# EAGLE design quad-ultimax-cartridge (EAGLE 9.4.0)
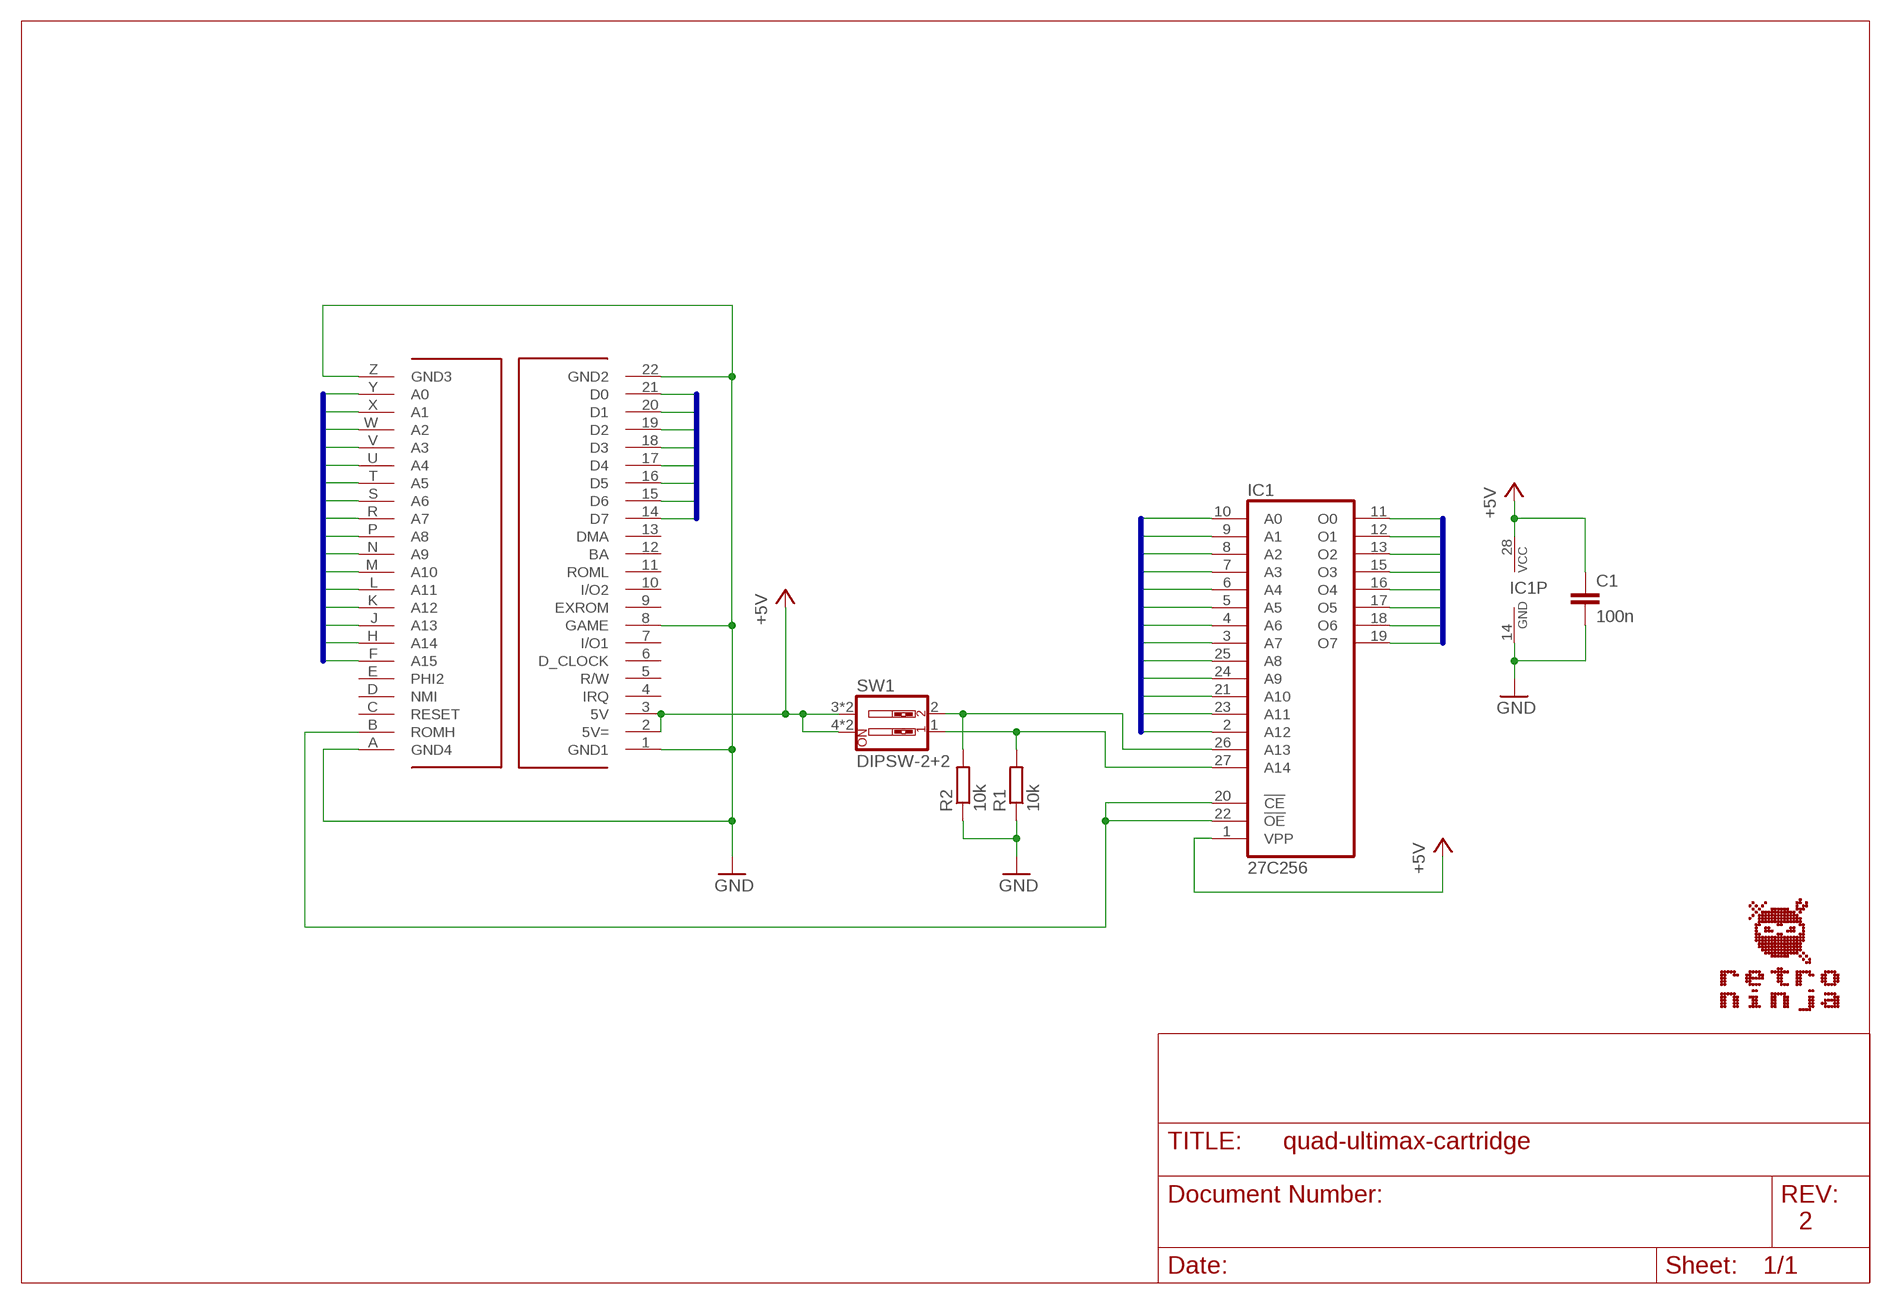
[diagram p0: schematic, sheet 1]

## Parts
C1  100n  CAPACITOR  [CAP_5MM_2.5X5.0_ROUND]
IC1  27C256  27256  [DIL28]
R1  10k  RESISTOR10MM  [0207/10]
R2  10k  RESISTOR10MM  [0207/10]
SW1  DIPSW-2+2  [DIPSW2+2]
U$1  C64CARTRIDGE_BOARD_CONNECTOR  [C64_CARTRIDGE_BOARDEDGE]

## Nets
+5V: C1.1 IC1.1(VPP) IC1.28(VCC) SW1.3 SW1.4 SW1.5 SW1.6 U$1.2(5V=) U$1.3(5V)
A0: IC1.10(A0) U$1.Y(A0)
A1: IC1.9(A1) U$1.X(A1)
A2: IC1.8(A2) U$1.W(A2)
A3: IC1.7(A3) U$1.V(A3)
A4: IC1.6(A4) U$1.U(A4)
A5: IC1.5(A5) U$1.T(A5)
A6: IC1.4(A6) U$1.S(A6)
A7: IC1.3(A7) U$1.R(A7)
A8: IC1.25(A8) U$1.P(A8)
A9: IC1.24(A9) U$1.N(A9)
A10: IC1.21(A10) U$1.M(A10)
A11: IC1.23(A11) U$1.L(A11)
A12: IC1.2(A12) U$1.K(A12)
A13: U$1.J(A13)
A14: U$1.H(A14)
A15: U$1.F(A15)
D0: IC1.11(O0) U$1.21(D0)
D1: IC1.12(O1) U$1.20(D1)
D2: IC1.13(O2) U$1.19(D2)
D3: IC1.15(O3) U$1.18(D3)
D4: IC1.16(O4) U$1.17(D4)
D5: IC1.17(O5) U$1.16(D5)
D6: IC1.18(O6) U$1.15(D6)
D7: IC1.19(O7) U$1.14(D7)
GND: C1.2 IC1.14(GND) R1.1 R2.1 U$1.1(GND1) U$1.8(GAME) U$1.22(GND2) U$1.A(GND4) U$1.Z(GND3)
N$1: IC1.20(!CE) IC1.22(!OE) U$1.B(ROMH)
N$2: IC1.26(A13) R2.2 SW1.2
N$3: IC1.27(A14) R1.2 SW1.1
Unconnected: U$1.4(IRQ) U$1.5(R/W) U$1.6(D_CLOCK) U$1.7(I/O1) U$1.9(EXROM) U$1.10(I/O2) U$1.11(ROML) U$1.12(BA) U$1.13(DMA) U$1.C(RESET) U$1.D(NMI) U$1.E(PHI2)

## Buses
DATA:D[0..7]
ADRESS:A[0..15]

## Notes on the sheet
- 2

## Library data of the parts
C1 = Per:CAPACITOR
IC1 = memory:27256: MEMORY
R1 R2 = Per:RESISTOR
SW1 = Per:DIPSW-2
U$1 = Per:C64CARTRIDGE_BOARD_CONNECTOR

## Board
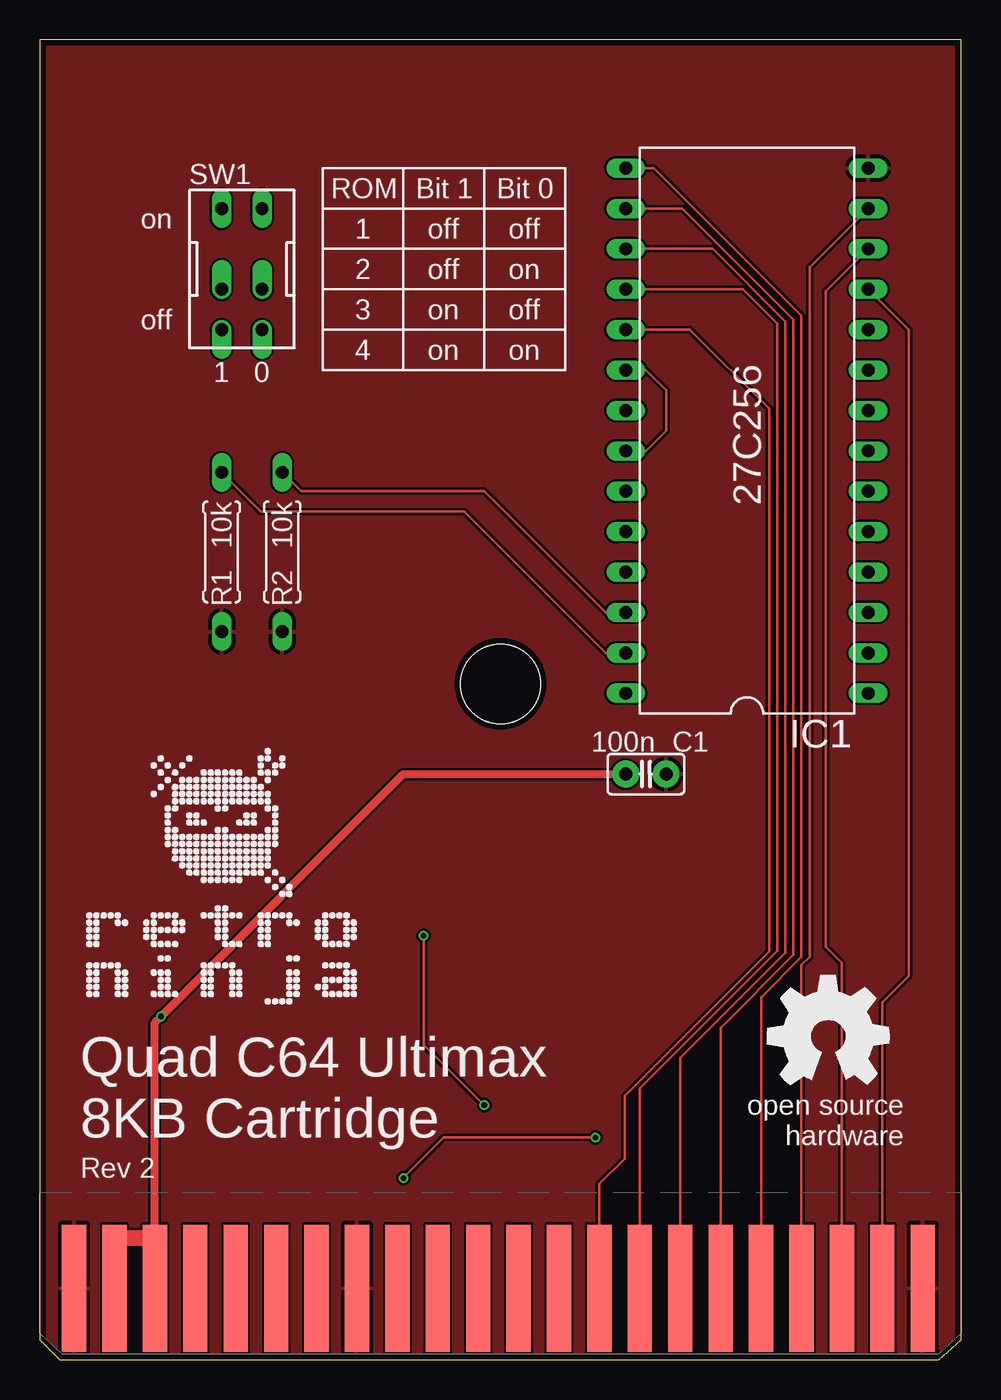
[diagram p1: board, top side]
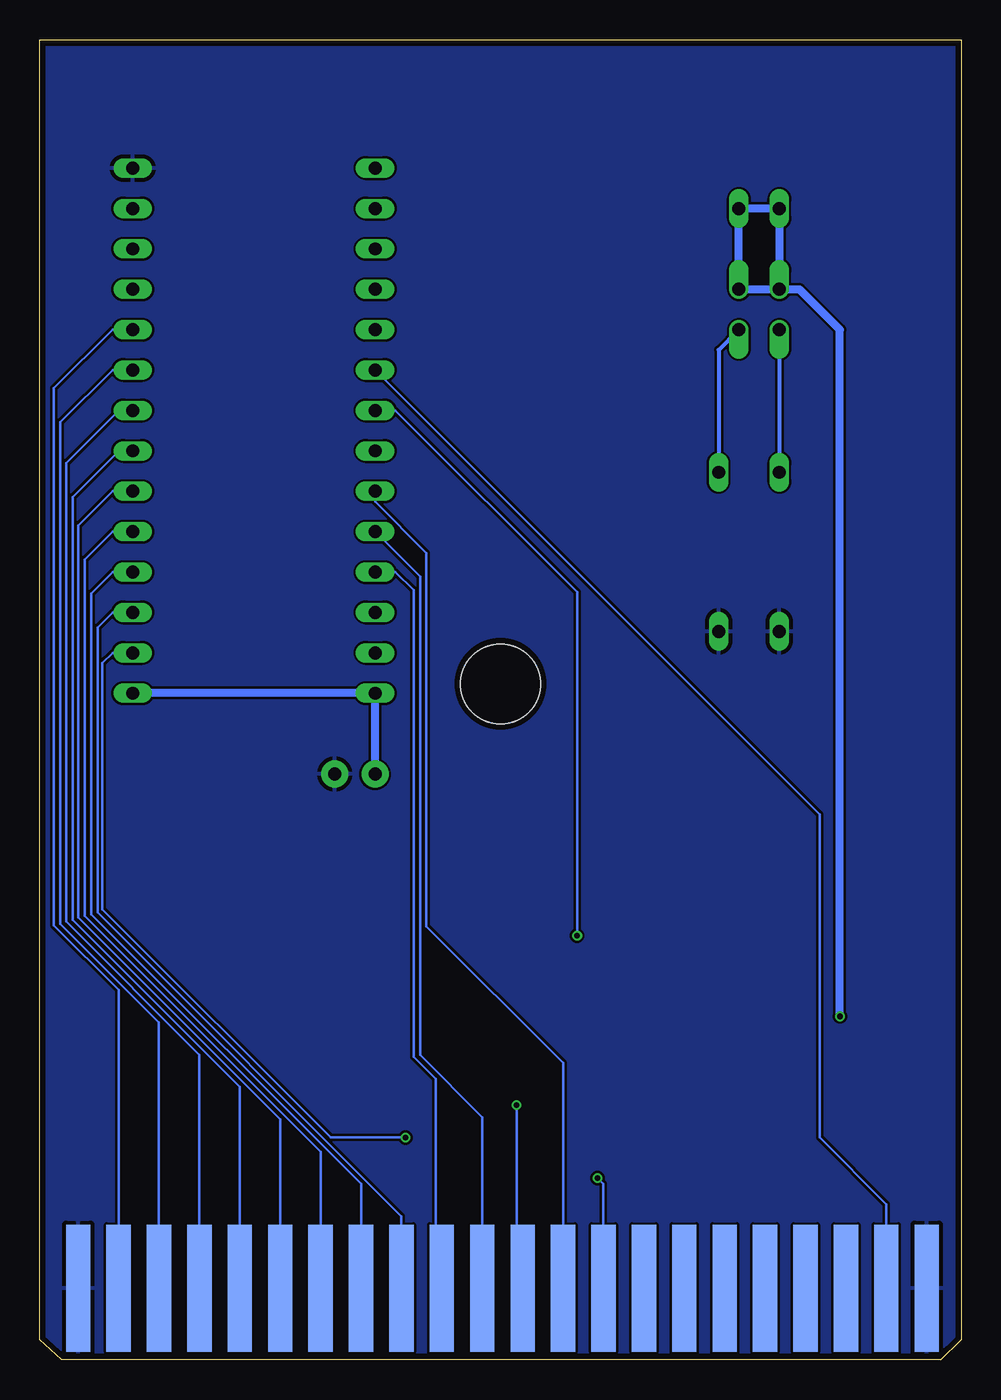
[diagram p2: board, bottom side, seen from below]

Size 57.91 x 83 mm. Coordinates in mm from the lower left corner, seen from the top.
Outline: 57.91,1.27 57.91,83 0,83 0,1.27 1.27,0 56.52,0 57.91,1.27
Copper layers (1*16): Top 0.035559375mm / dielectric 1.6mm / Bottom 0.035559375mm
Design rules "oshpark-2layer": minimum track width 6mil, minimum drill 10mil, track to track 6mil, track to pad 6mil, pad to pad 6mil, via to via 6mil, smd to smd 6mil, copper to edge 15mil, drill to drill 6mil, minimum pad ring 5mil, minimum via ring 5mil, stop-mask expansion 2.5mil, vias tented up to drill 0mil, thermal gap 10mil
Holes 5 mm at 28.96,42.5

### Footprints (pad centres in the part's own frame; a part is rotated, then mirrored left to right if it is on the bottom)
CAP_5MM_2.5X5.0_ROUND = drill 0.813 pad 1.676: 1 -1.27,0; 2 1.27,0
DIL28 = drill 0.813 long: 1 -16.51,-7.62; 2 -13.97,-7.62; 3 -11.43,-7.62; 4 -8.89,-7.62; 5 -6.35,-7.62; 6 -3.81,-7.62; 7 -1.27,-7.62; 8 1.27,-7.62; 9 3.81,-7.62; 10 6.35,-7.62; 11 8.89,-7.62; 12 11.43,-7.62; 13 13.97,-7.62; 14 16.51,-7.62; 15 16.51,7.62; 16 13.97,7.62; 17 11.43,7.62; 18 8.89,7.62; 19 6.35,7.62; 20 3.81,7.62; 21 1.27,7.62; 22 -1.27,7.62; 23 -3.81,7.62; 24 -6.35,7.62; 25 -8.89,7.62; 26 -11.43,7.62; 27 -13.97,7.62; 28 -16.51,7.62
0207/10 = drill 0.813 long: 1 -5,0; 2 5,0
DIPSW2+2 = drill 0.813 offset: 1 -1.27,-3.81; 2 1.27,-3.81; 5 1.27,-1.27; 6 -1.27,-1.27 | drill 0.813 long: 3 1.27,3.81; 4 -1.27,3.81
C64_CARTRIDGE_BOARDEDGE = smd 1.524 x 8.001: 1 2.159,4.115; 2 4.699,4.115; 3 7.239,4.115; 4 9.779,4.115; 5 12.319,4.115; 6 14.859,4.115; 7 17.399,4.115; 8 19.939,4.115; 9 22.479,4.115; 10 25.019,4.115; 11 27.559,4.115; 12 30.099,4.115; 13 32.639,4.115; 14 35.179,4.115; 15 37.719,4.115; 16 40.259,4.115; 17 42.799,4.115; 18 45.339,4.115; 19 47.879,4.115; 20 50.419,4.115; 21 52.959,4.115; 22 55.499,4.115 | smd 1.524 x 8.001 bottom: A 2.159,4.115; B 4.699,4.115; C 7.239,4.115; D 9.779,4.115; E 12.319,4.115; F 14.859,4.115; H 17.399,4.115; J 19.939,4.115; K 22.479,4.115; L 25.019,4.115; M 27.559,4.115; N 30.099,4.115; P 32.639,4.115; R 35.179,4.115; S 37.719,4.115; T 40.259,4.115; U 42.799,4.115; V 45.339,4.115; W 47.879,4.115; X 50.419,4.115; Y 52.959,4.115; Z 55.499,4.115

### Placement (x,y rotation side)
C1  38.1,36.83 0 top
IC1  44.45,58.42 90 top
R1  11.43,50.8 90 top
R2  15.24,50.8 90 top
SW1  12.7,68.58 0 top
U$1  0,0.38 0 top
U$2  [RETRONINJA_TEXT_17MM]  11.43,29.21 0 top
U$3  [OSHW_8MM]  49.53,20.32 0 top

### Tracks (layer width: path | path; a pad name or v marks a point on that pad's centre or on a via)
+5V  (via drill 0.35)
  Top 0.254: U$1.3 7.24,7.62 | 5.08,7.62 4.7,7.24 U$1.2
  Top 0.508: U$1.3 7.24,21.21 v7.62,21.59 22.86,36.83 C1.1
  Top 1.016: 7.24,7.62 5.08,7.62
  Bottom 0.508: IC1.1 IC1.28 C1.1 | v7.62,21.59 7.62,64.77 10.16,67.31 SW1.6 | SW1.6 SW1.4 SW1.3 SW1.5 SW1.6
A0
  Bottom 0.152: IC1.10 53.34,64.77 57.02,61.09 57.02,27.3 52.96,23.24 U$1.Y
A1
  Bottom 0.152: IC1.9 53.34,62.23 56.62,58.95 56.62,27.41 50.42,21.21 U$1.X
A2
  Bottom 0.152: IC1.8 52.96,59.69 56.26,56.39 56.26,27.56 47.88,19.18 U$1.W
A3
  Bottom 0.152: IC1.7 52.96,57.15 55.85,54.25 55.85,27.66 45.34,17.14 U$1.V
A4
  Bottom 0.152: IC1.6 53.34,54.61 55.5,52.45 55.5,27.81 42.8,15.11 U$1.U
A5
  Bottom 0.152: IC1.5 53.34,52.07 55.09,50.32 55.09,27.91 40.26,13.08 U$1.T
A6
  Bottom 0.152: IC1.4 53.34,49.53 54.69,48.18 54.69,28.02 37.72,11.05 U$1.S
A7
  Bottom 0.152: IC1.3 53.34,46.99 54.28,46.05 54.28,28.12 35.18,9.02 U$1.R
A8
  Bottom 0.152: IC1.25 35.56,49.53 34.42,48.39 34.42,19.05 33.02,17.65 33.02,4.75 U$1.P
A9
  Bottom 0.152: IC1.24 34.01,49.25 34.01,19.17 30.1,15.25 U$1.N
A10  (via drill 0.35)
  Top 0.152: v27.94,16 24.13,19.81 v24.13,26.67
  Bottom 0.152: v27.94,16 27.94,4.75 U$1.M | v24.13,26.67 24.13,48.26 35.56,59.69 IC1.21
A11
  Bottom 0.152: IC1.23 36.83,53.95 33.6,50.73 33.6,27.25 25.02,18.67 U$1.L
A12  (via drill 0.35)
  Top 0.152: v34.92,13.97 25.4,13.97 v22.86,11.43
  Bottom 0.152: IC1.2 53.34,44.45 53.98,43.81 53.98,28.32 39.62,13.97 v34.92,13.97 | v22.86,11.43 22.48,11.05 U$1.K
D0
  Top 0.152: IC1.11 54.61,64.77 54.61,24.13 52.96,22.48 U$1.21
D1
  Top 0.152: IC1.12 49.4,67.18 49.4,25.96 50.42,24.94 U$1.20
D2
  Top 0.152: IC1.13 48.39,68.71 48.39,25.32 47.88,24.82 U$1.19
D3
  Top 0.152: IC1.15 38.61,74.93 47.88,65.66 47.88,25.32 45.34,22.78 U$1.18
D4
  Top 0.152: IC1.16 40.39,72.39 47.37,65.41 47.37,25.45 42.8,20.88 U$1.17
D5
  Top 0.152: IC1.17 42.29,69.85 46.86,65.28 46.86,25.58 40.26,18.97 U$1.16
D6
  Top 0.152: U$1.15 37.72,17.07 46.35,25.7 46.35,65.15 44.2,67.31 IC1.18
D7
  Top 0.152: IC1.19 40.87,64.77 45.85,59.79 45.85,25.68 36.76,16.59 36.76,12.62 35.18,11.05 U$1.14
GND
  pour Bottom: -1,-1 -1,84 58.91,84 58.91,-1
  pour Top: -1,-1 -1,84 58.91,84 58.91,-1
N$1
  Top 0.152: IC1.22 38.1,57.15 39.37,58.42 39.37,60.96 38.1,62.23 IC1.20
  Bottom 0.152: IC1.20 8.89,34.29 8.89,13.97 4.7,9.78 U$1.B
N$2
  Top 0.152: IC1.26 35.56,46.99 27.94,54.61 16.43,54.61 R2.2
  Bottom 0.254: SW1.2 15.24,63.5 R2.2
N$3
  Top 0.152: IC1.27 35.56,44.45 26.67,53.34 13.89,53.34 R1.2
  Bottom 0.254: SW1.1 R1.2

### Text on the board
tPlace: ROM | Bit 1 | Bit 0 | on | 1 | off | off | 2 | off | on | off | 3 | on | off | 4 | on | on | 1 | 0 | Quad C64 Ultimax / 8KB Cartridge | Rev 2